# EAGLE design esphome-lg-pqrcuds0-rev2 (EAGLE 9.6.2)
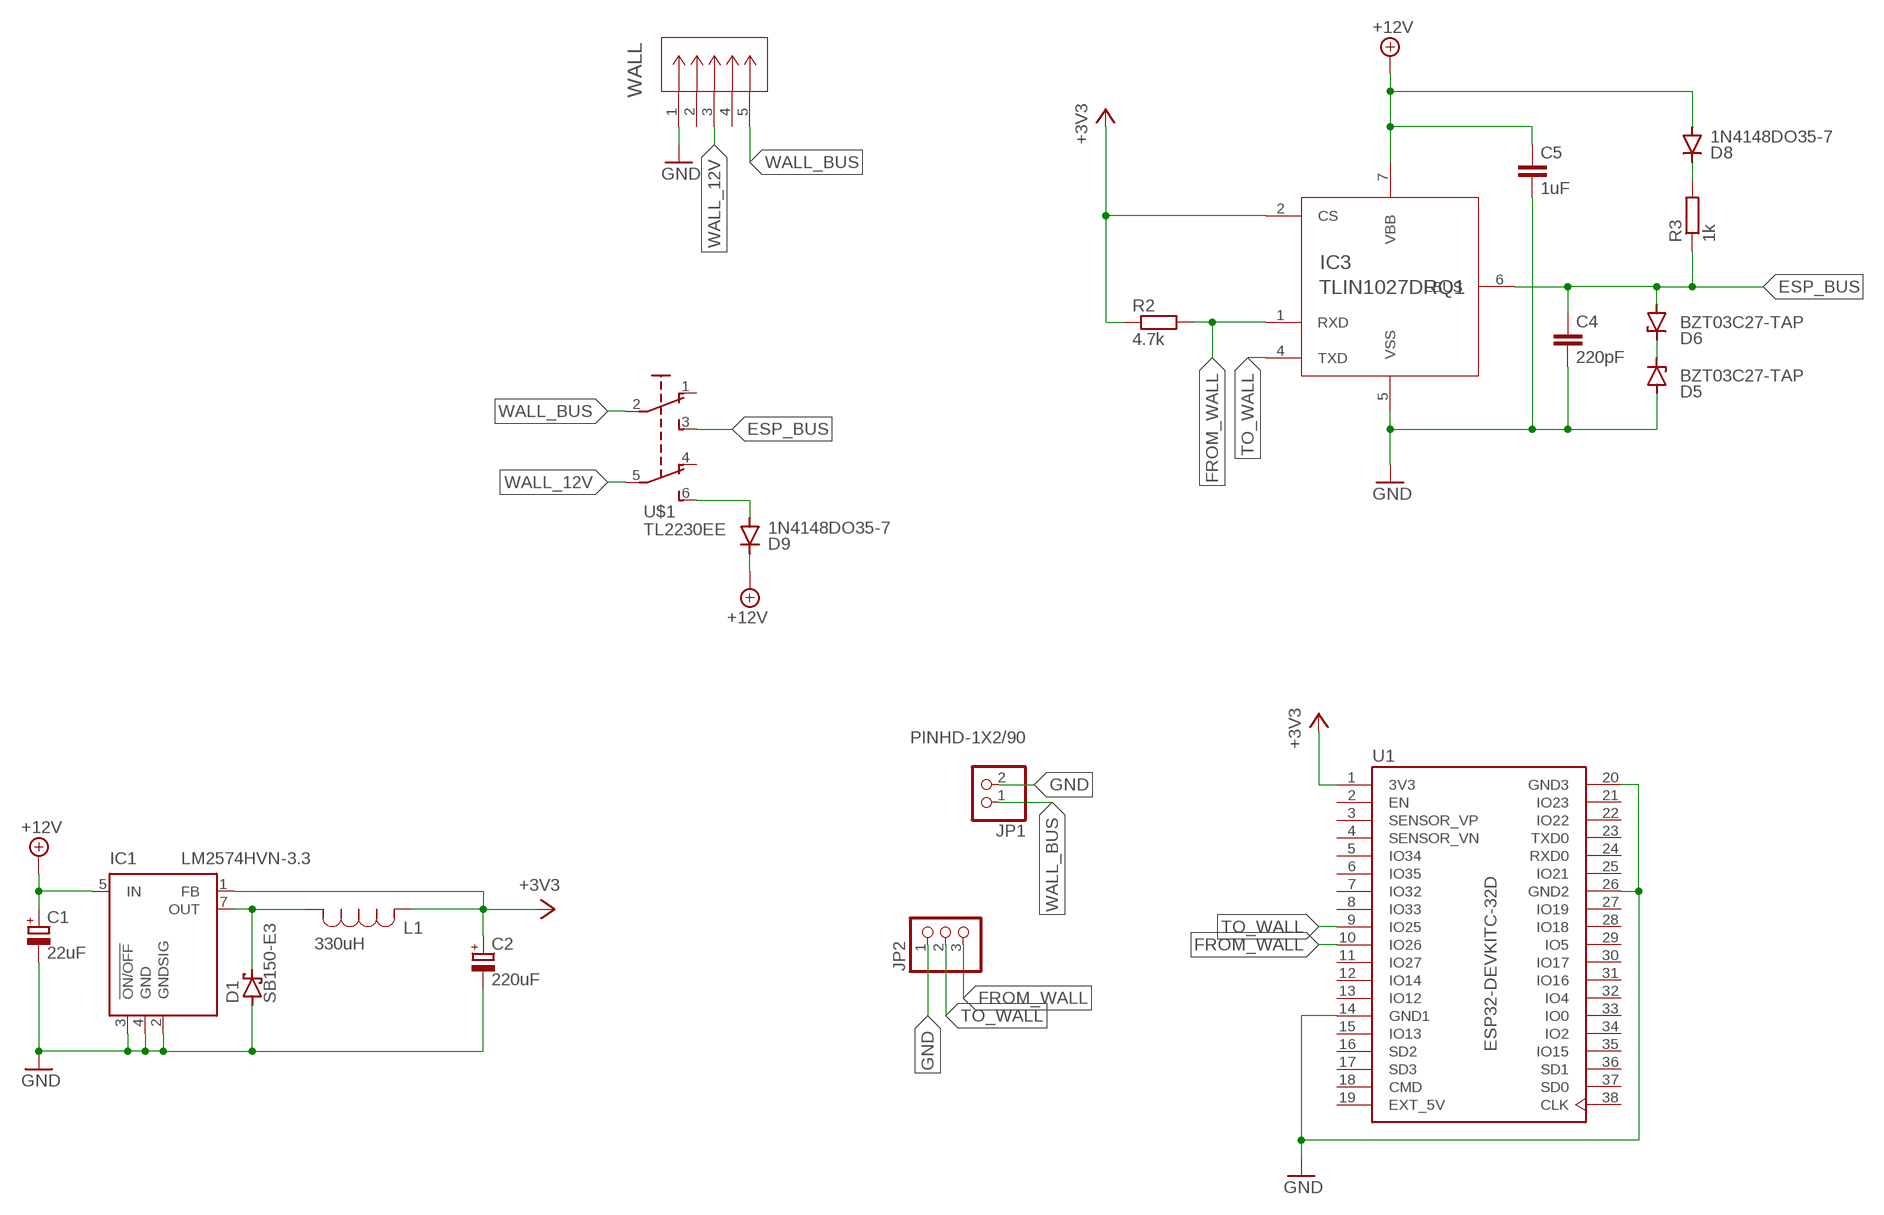
[diagram p0: schematic, sheet 1]

## Parts
C1  22uF  CPOL-EUE2.5-6  [E2,5-6]
C2  220uF  CPOL-EUE2,5-6E  [E2,5-6E]
C4  220pF  C-EU050-025X075  [C050-025X075]
C5  1uF  C-EU050-025X075  [C050-025X075]
D1  SB150-E3  SCHOTTKY-DIODEDO35-7  [DO35-7]
D5  BZT03C27-TAP  ZENER-DIODESOD57-10  [SOD57Z10]
D6  BZT03C27-TAP  ZENER-DIODESOD57-10  [SOD57Z10]
D8  1N4148DO35-7  [DO35-7]
D9  1N4148DO35-7  [DO35-7]
IC1  LM2574HVN-3.3  [DIL08]
IC3  TLIN1027DRQ1  [SOIC8]
JP1  PINHD-1X2/90  [1X02/90]
JP2  PINHD-1X3/90  [1X03/90]
L1  330uH  AIAP-02-331K  [AIAP-02_ABR]
R2  4.7k  R-EU_0204/7  [0204/7]
R3  1k  R-EU_0204/7  [0204/7]
U1  ESP32-DEVKITC-32D  [MODULE_ESP32-DEVKITC-32D]
U$1  TL2230EE  [TL2230]
WALL  S5B-ZR(LF)(SN)  [CONN_S5B-ZR_JST]

## Nets
+3V3: C2.+ IC1.1(FB) IC3.2(CS) L1.2 R2.1 U1.1(3V3)
+12V: C1.+ C5.1 D8.A D9.C IC1.5(IN) IC3.7(VBB)
ESP_BUS: C4.1 D6.A IC3.6(LBUS) R3.1 U$1.3(S)
FROM_WALL: IC3.1(RXD) JP2.3 R2.2 U1.10(IO26)
GND: C1.- C2.- C4.2 C5.2 D1.A D5.A IC1.2(GNDSIG) IC1.3(!ON/OFF) IC1.4(GND) IC3.5(VSS) JP1.2 JP2.1 U1.14(GND1) U1.20(GND3) U1.26(GND2) WALL.1
N$1: D9.A U$1.6(S1)
N$2: D1.C IC1.7(OUT) L1.1
N$3: D8.C R3.2
N$8: D5.C D6.C
TO_WALL: IC3.4(TXD) JP2.2 U1.9(IO25)
WALL_12V: U$1.5(P1) WALL.3
WALL_BUS: JP1.1 U$1.2(P) WALL.5
Unconnected: U1.2(EN) U1.3(SENSOR_VP) U1.4(SENSOR_VN) U1.5(IO34) U1.6(IO35) U1.7(IO32) U1.8(IO33) U1.11(IO27) U1.12(IO14) U1.13(IO12) U1.15(IO13) U1.16(SD2) U1.17(SD3) U1.18(CMD) U1.21(IO23) U1.22(IO22) U1.23(TXD0) U1.24(RXD0) U1.25(IO21) U1.27(IO19) U1.28(IO18) U1.29(IO5) U1.30(IO17) U1.31(IO16) U1.32(IO4) U1.33(IO0) U1.34(IO2) U1.35(IO15) U1.36(SD1) U1.37(SD0) U1.38(CLK) U$1.1(O) U$1.4(O1) WALL.2 WALL.4

## Power pins joined to a net without a drawn wire
EXT_5V: U1.19(EXT_5V)

## Library data of the parts
C1 C2 = rcl:CPOL-EU: POLARIZED CAPACITOR, European symbol; SPICEPREFIX: C
C4 C5 = rcl:C-EU: CAPACITOR, European symbol; SPICEPREFIX: C
D1 = diode:SCHOTTKY-DIODE: Schottky Diode
D5 D6 = diode:ZENER-DIODE: Z-Diode
D8 D9 = diode:1N4148: DIODE high speed (Philips)
IC1 = linear:LM2574?-*: SIMPLE SWITCHER 0.5A Step-Down Voltage Regulator Source: http://cache.national.com/ds/LM/LM2574.pdf
IC3 = flameeyes:TLIN1027DRQ1
JP1 = Connector:PINHD-1X2: PIN HEADER; CATEGORY: CONNECTOR; SUB-CATEGORY: PIN-HEADER
JP2 = pinhead:PINHD-1X3: PIN HEADER
L1 = flameeyes:AIAP-02-331K; BUILT_BY: EMA_UL_Team; MANUFACTURER_PART_NUMBER: AIAP-02-331K; SOURCELIBRARY: Abracon_2013_02_05_AIAP_Series; VENDOR: Abracon
R2 R3 = rcl:R-EU_: RESISTOR, European symbol; SPICEPREFIX: R
U1 = ESP32-DEVKITC-32D:ESP32-DEVKITC-32D: Eval Board For Esp-Wroom-32 Check prices <https://pricing.snapeda.com/parts/ESP32-DEVKITC-32D/Espressif%20Systems/view-part?ref=eda>; AVAILABILITY: Warning; DESCRIPTION: WiFi Development Tools (802.11) ESP32 General Development Kit, ESP32-WROOM-32D on the board; MF: Espressif Systems; MP: ESP32-DEVKITC-32D; PACKAGE: None; PRICE: None; PURCHASE-URL: https://pricing.snapeda.com/search/part/ESP32-DEVKITC-32D/?ref=eda
U$1 = flameeyes:TL2230EE
WALL = flameeyes:S5B-ZR(LF)(SN); BUILT_BY: EMA_Cory; COPYRIGHT: Copyright (C) 2018 Accelerated Designs. All rights reserved; DATASHEET: https://www.jst-mfg.com/product/pdf/eng/eZH.pdf; MANUFACTURER_PART_NUMBER: S5B-ZR(LF)(SN); SOURCELIBRARY: Add_to_database_2021-03-29; VENDOR: JST

## Board
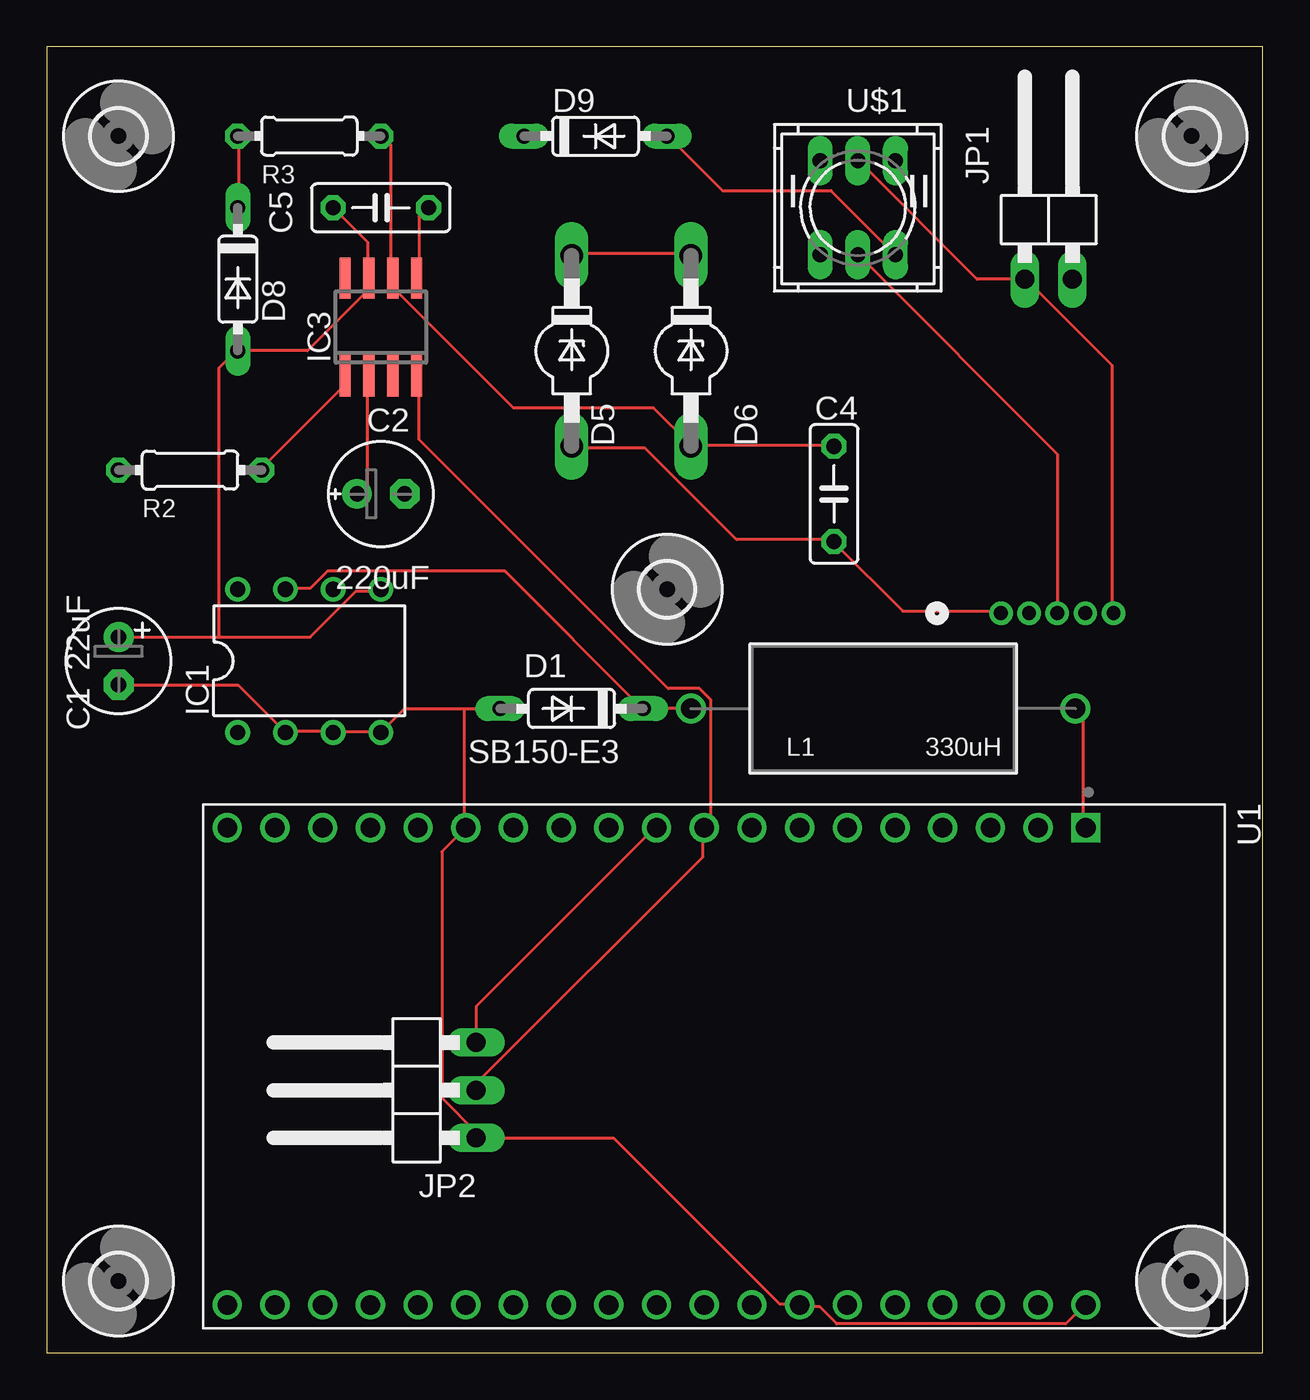
[diagram p1: board, top side]
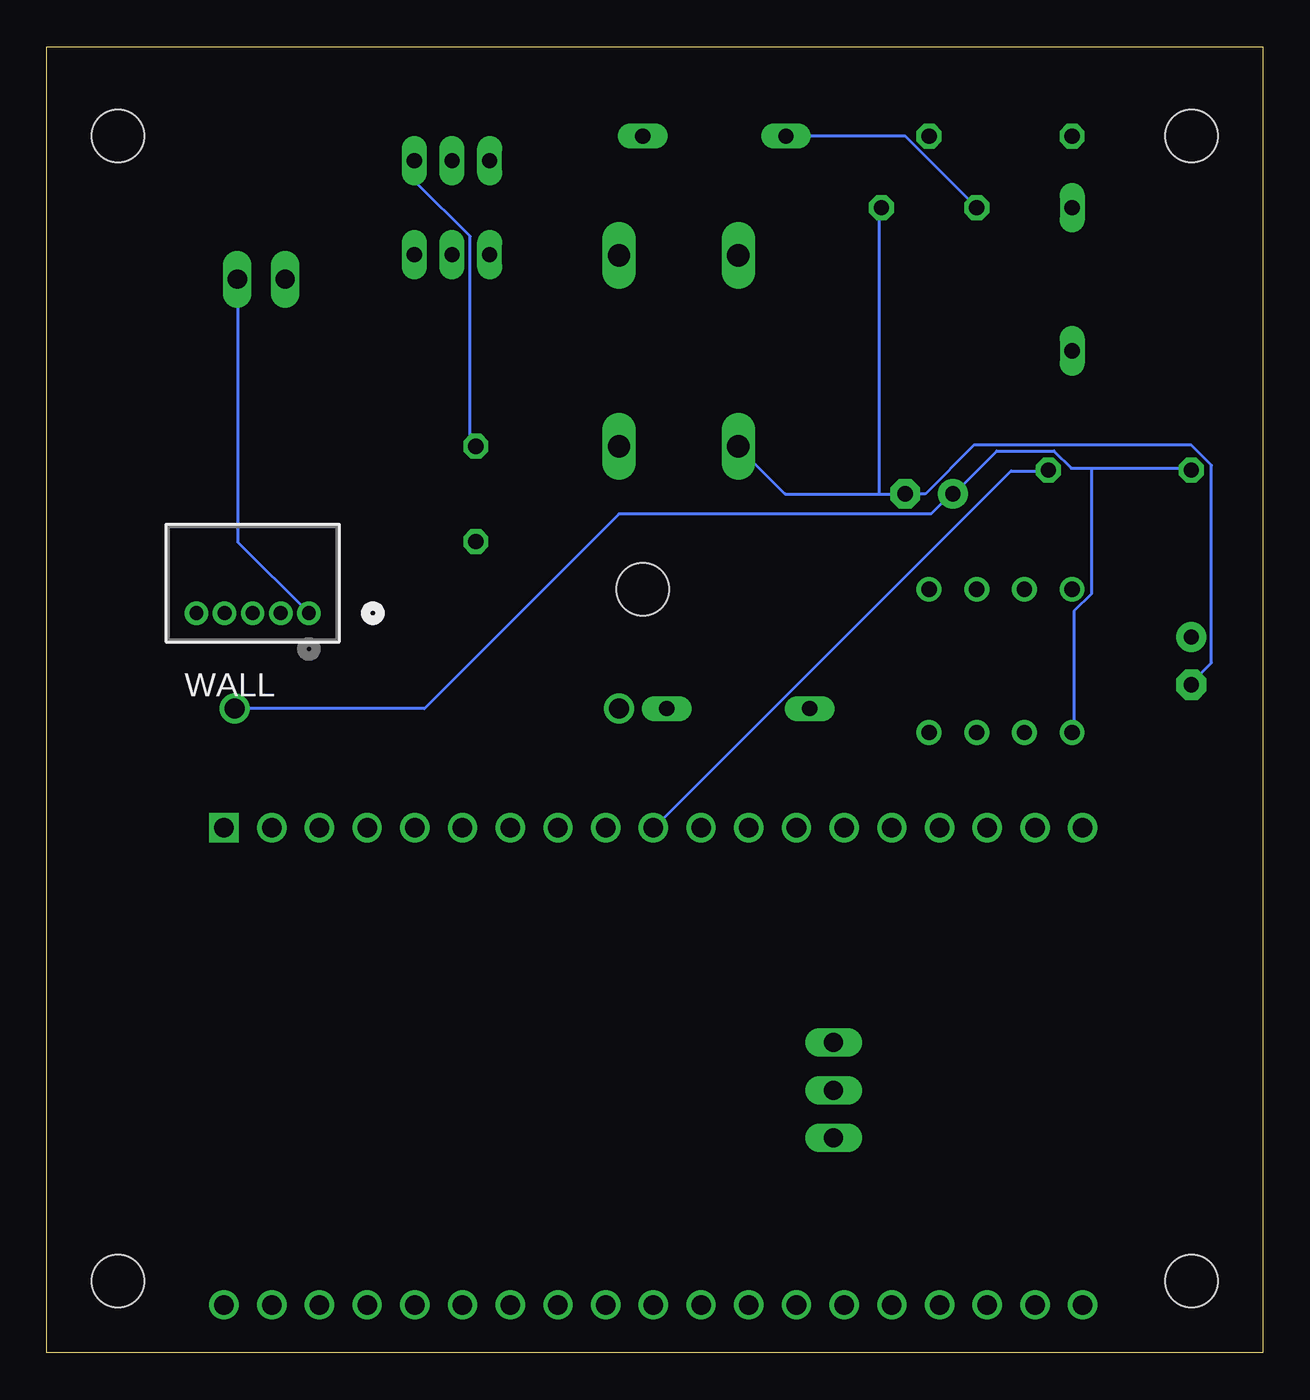
[diagram p2: board, bottom side, seen from below]

Size 64.75 x 69.52 mm. Coordinates in mm from the lower left corner, seen from the top.
Outline: 0,0 64.75,0 64.75,69.52 0,69.52 0,0
Copper layers (1*16): Top 0.035mm / dielectric 1.5mm / Bottom 0.035mm
Design rules "default": minimum track width 6mil, minimum drill 0.35mm, track to track 6mil, track to pad 6mil, pad to pad 6mil, via to via 6mil, smd to smd 6mil, copper to edge 40mil, drill to drill 6mil, minimum pad ring 10mil, minimum via ring 8mil, stop-mask expansion 4mil, vias tented up to drill 0mil, thermal gap 10mil

### Footprints (pad centres in the part's own frame; a part is rotated, then mirrored left to right if it is on the bottom)
E2,5-6 = drill 0.813 pad 1.6: + -1.27,0 | drill 0.813 pad 1.6 octagon: - 1.27,0
E2,5-6E = drill 0.813 pad 1.575: + -1.27,0 | drill 0.813 pad 1.575 octagon: - 1.27,0
C050-025X075 = drill 0.813 octagon: 1 -2.54,0; 2 2.54,0
DO35-7 = drill 0.813 long: A 3.81,0; C -3.81,0
SOD57Z10 = drill 1.194 long: A 5.08,0; C -5.08,0
DIL08 = drill 0.813 pad 1.27: 1 -3.81,-3.81; 2 -1.27,-3.81; 3 1.27,-3.81; 4 3.81,-3.81; 5 3.81,3.81; 6 1.27,3.81; 7 -1.27,3.81; 8 -3.81,3.81
SOIC8 = smd 0.6 x 2.2: 1 -1.905,-2.6; 2 -0.635,-2.6; 3 0.635,-2.6; 4 1.905,-2.6; 5 1.905,2.6; 6 0.635,2.6; 7 -0.635,2.6; 8 -1.905,2.6
1X02/90 = drill 1.016 long: 1 -1.27,-3.81; 2 1.27,-3.81
1X03/90 = drill 1.016 long: 1 -2.54,-3.81; 2 0,-3.81; 3 2.54,-3.81
AIAP-02_ABR = drill 1.067 pad 1.575: 1 0,0; 2 20.472,0
0204/7 = drill 0.813 octagon: 1 -3.81,0; 2 3.81,0
MODULE_ESP32-DEVKITC-32D = drill 1.04 square: 1 -12.7,19.76 | drill 1.04: 2 -12.7,17.22; 3 -12.7,14.68; 4 -12.7,12.14; 5 -12.7,9.6; 6 -12.7,7.06; 7 -12.7,4.52; 8 -12.7,1.98; 9 -12.7,-0.56; 10 -12.7,-3.1; 11 -12.7,-5.64; 12 -12.7,-8.18; 13 -12.7,-10.72; 14 -12.7,-13.26; 15 -12.7,-15.8; 16 -12.7,-18.34; 17 -12.7,-20.88; 18 -12.7,-23.42; 19 -12.7,-25.96; 20 12.7,19.76; 21 12.7,17.22; 22 12.7,14.68; 23 12.7,12.14; 24 12.7,9.6; 25 12.7,7.06; 26 12.7,4.52; 27 12.7,1.98; 28 12.7,-0.56; 29 12.7,-3.1; 30 12.7,-5.64; 31 12.7,-8.18; 32 12.7,-10.72; 33 12.7,-13.26; 34 12.7,-15.8; 35 12.7,-18.34; 36 12.7,-20.88; 37 12.7,-23.42; 38 12.7,-25.96
TL2230 = drill 0.813 long: 1 -2,2.5; 2 0,2.5; 3 2,2.5; 4 -2,-2.5; 5 0,-2.5; 6 2,-2.5
2,8 = hole 2.8: 0,0
CONN_S5B-ZR_JST = drill 0.737 pad 1.245: 1 0,0; 2 1.499,0; 3 2.997,0; 4 4.496,0; 5 5.994,0

### Placement (x,y rotation side)
C1  3.81,36.83 270 top
C2  17.78,45.72 0 top
C4  41.91,45.72 270 top
C5  17.78,60.96 0 top
D1  27.94,34.29 180 top
D5  27.94,53.34 270 top
D6  34.29,53.34 270 top
D8  10.16,57.15 270 top
D9  29.21,64.77 0 top
IC1  13.97,36.83 0 top
IC3  17.78,54.61 0 top
JP1  53.34,60.96 0 top
JP2  19.05,13.97 90 top
L1  34.29,34.29 0 top
R2  7.62,46.99 0 top
R3  13.97,64.77 180 top
U1  35.56,15.24 270 top
U$1  43.18,60.96 0 top
U$2  [2,8]  60.96,64.77 0 top
U$3  [2,8]  3.81,3.81 0 top
U$4  [2,8]  60.96,3.81 0 top
U$5  [2,8]  33.02,40.64 0 top
U$6  [2,8]  3.81,64.77 0 top
WALL  50.8,39.37 180 bottom

### Tracks (layer width: path | path; a pad name or v marks a point on that pad's centre or on a via)
+3V3
  Top 0.152: U1.1 55.17,28.04 55.17,33.98 54.86,34.29 L1.2 | IC3.2 17.07,51.97 17.07,46.18 16.61,45.72 C2.+
  Bottom 0.152: 9.14,47.09 10.21,47.09 11.12,48.01 14.17,48.01 16.46,45.72 C2.+ 16.61,45.72 17.68,44.65 34.29,44.65 44.65,34.29 L1.2 | 9.14,47.09 3.81,47.09 R2.1 | 9.14,47.09 9.14,40.39 10.06,39.47 10.06,33.07 IC1.1
+12V
  Top 0.152: C1.+ 9.14,38.1 | 9.14,38.1 14.02,38.1 16.46,40.54 17.68,40.54 IC1.5 | C5.1 17.07,59.13 17.07,57.3 IC3.7 17.07,57.15 17.07,56.54 13.87,53.34 D8.A 10.06,53.34 9.14,52.43 9.14,38.1
  Bottom 0.152: D9.C 19.05,64.77 C5.1
ESP_BUS
  Top 0.152: R3.1 17.83,64.77 18.29,64.31 18.29,57.3 IC3.6 18.44,57.15 18.44,56.69 24.84,50.29 32.31,50.29 34.29,48.31 | 34.29,48.31 41.91,48.31 C4.1 | 34.29,48.31 D6.A
  Bottom 0.152: U$1.3 45.11,63.4 45.11,62.33 42.22,59.44 42.22,48.62 41.91,48.31 C4.1
FROM_WALL
  Top 0.152: IC3.1 15.85,51.97 15.85,51.51 11.43,47.09 R2.2 | JP2.3 22.86,18.44 32.31,27.89 U1.10
  Bottom 0.152: R2.2 11.43,46.94 13.41,46.94 32.31,28.04 U1.10
GND
  Top 0.152: IC3.5 19.81,57.3 19.81,60.5 20.27,60.96 C5.2 | WALL.1 50.75,39.47 45.57,39.47 41.91,43.13 C4.2 41.91,43.28 36.73,43.28 31.85,48.16 28.04,48.16 D5.A | 15.24,33.07 12.8,33.07 IC1.2 10.21,35.51 3.81,35.51 C1.- | 15.24,33.07 17.68,33.07 IC1.4 19.05,34.29 22.25,34.29 | 15.24,33.07 IC1.3 | 22.25,34.29 D1.A | U1.20 55.17,2.44 54.25,1.52 42.06,1.52 41.15,2.44 40.08,2.44 U1.26 39.93,2.59 39.01,2.59 30.17,11.43 JP2.1 22.86,11.73 21.03,13.56 21.03,26.67 22.25,27.89 U1.14 22.25,28.04 22.25,34.29
  Bottom 0.152: 20.42,45.72 25.45,45.72 27.89,48.16 D5.A | 20.42,45.72 C2.- 17.98,45.72 15.39,48.31 3.81,48.31 2.74,47.24 2.74,36.73 3.81,35.66 C1.- | 20.42,45.72 20.42,60.96 C5.2 | WALL.1 54.56,43.13 54.56,57.15 JP1.2
N$1
  Top 0.152: U$1.6 45.11,58.52 41.76,61.87 35.97,61.87 33.07,64.77 D9.A
N$2
  Top 0.152: L1.1 D1.C 31.7,34.29 24.38,41.6 14.94,41.6 14.02,40.69 12.8,40.69 IC1.7
N$3
  Top 0.152: D8.C 10.21,60.96 10.21,64.77 R3.2
N$8
  Top 0.152: D5.C 28.04,58.52 34.29,58.52 D6.C
TO_WALL
  Top 0.152: IC3.4 19.81,51.97 19.81,48.62 33.07,35.36 34.75,35.36 35.36,34.75 35.36,28.35 35.05,28.04 U1.9 34.9,27.89 34.9,26.36 22.86,14.33 JP2.2
WALL_12V
  Top 0.152: WALL.3 53.8,47.85 43.28,58.37 U$1.5
WALL_BUS
  Top 0.152: WALL.5 56.69,39.47 56.69,52.58 52.12,57.15 JP1.1 49.53,57.15 43.28,63.4 U$1.2